# Altium schematic sheet MCU.SchDoc
size 566 x 398 mm; SheetNumber: 2; SheetTotal: 4
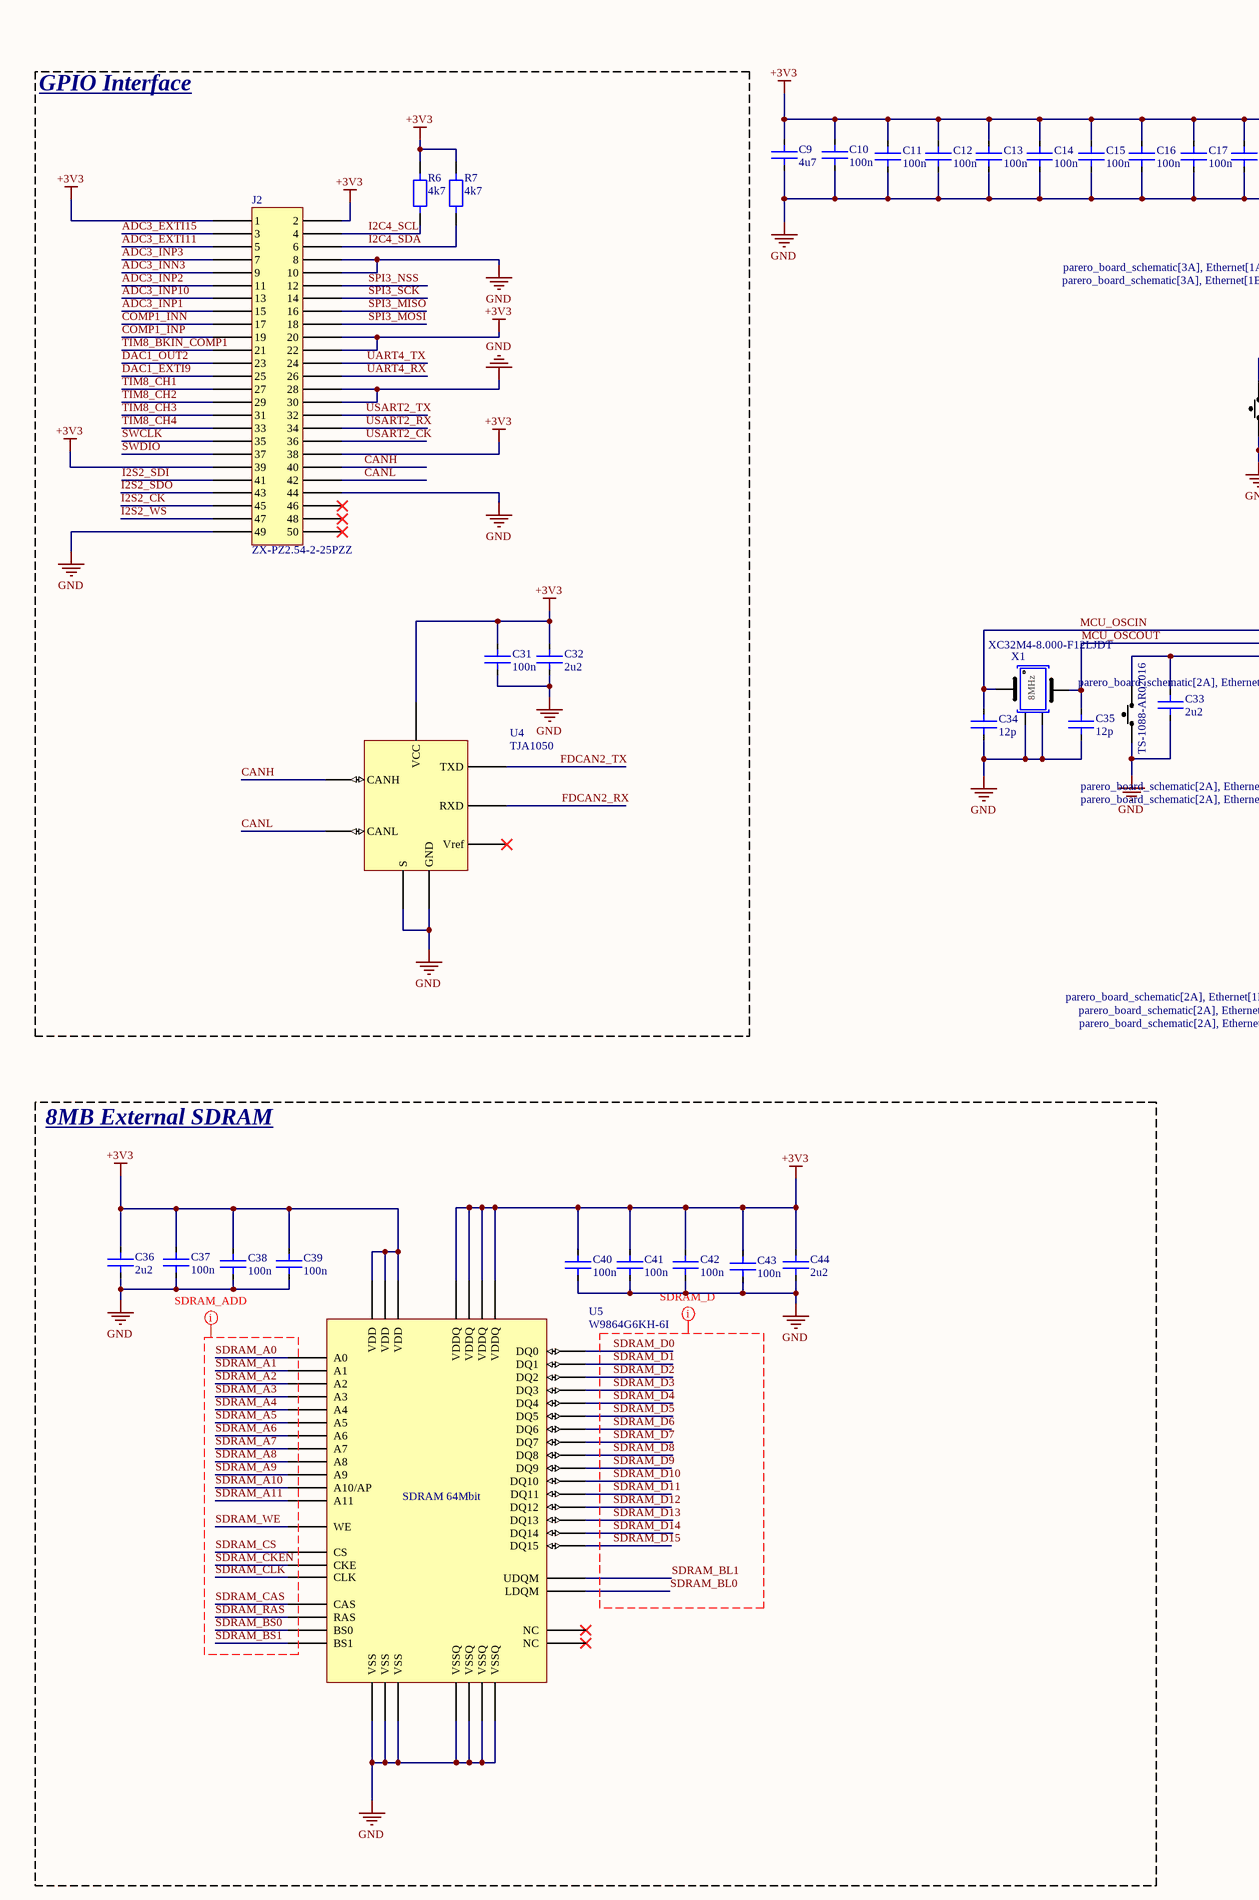
[diagram p0: MCU.SchDoc, left]
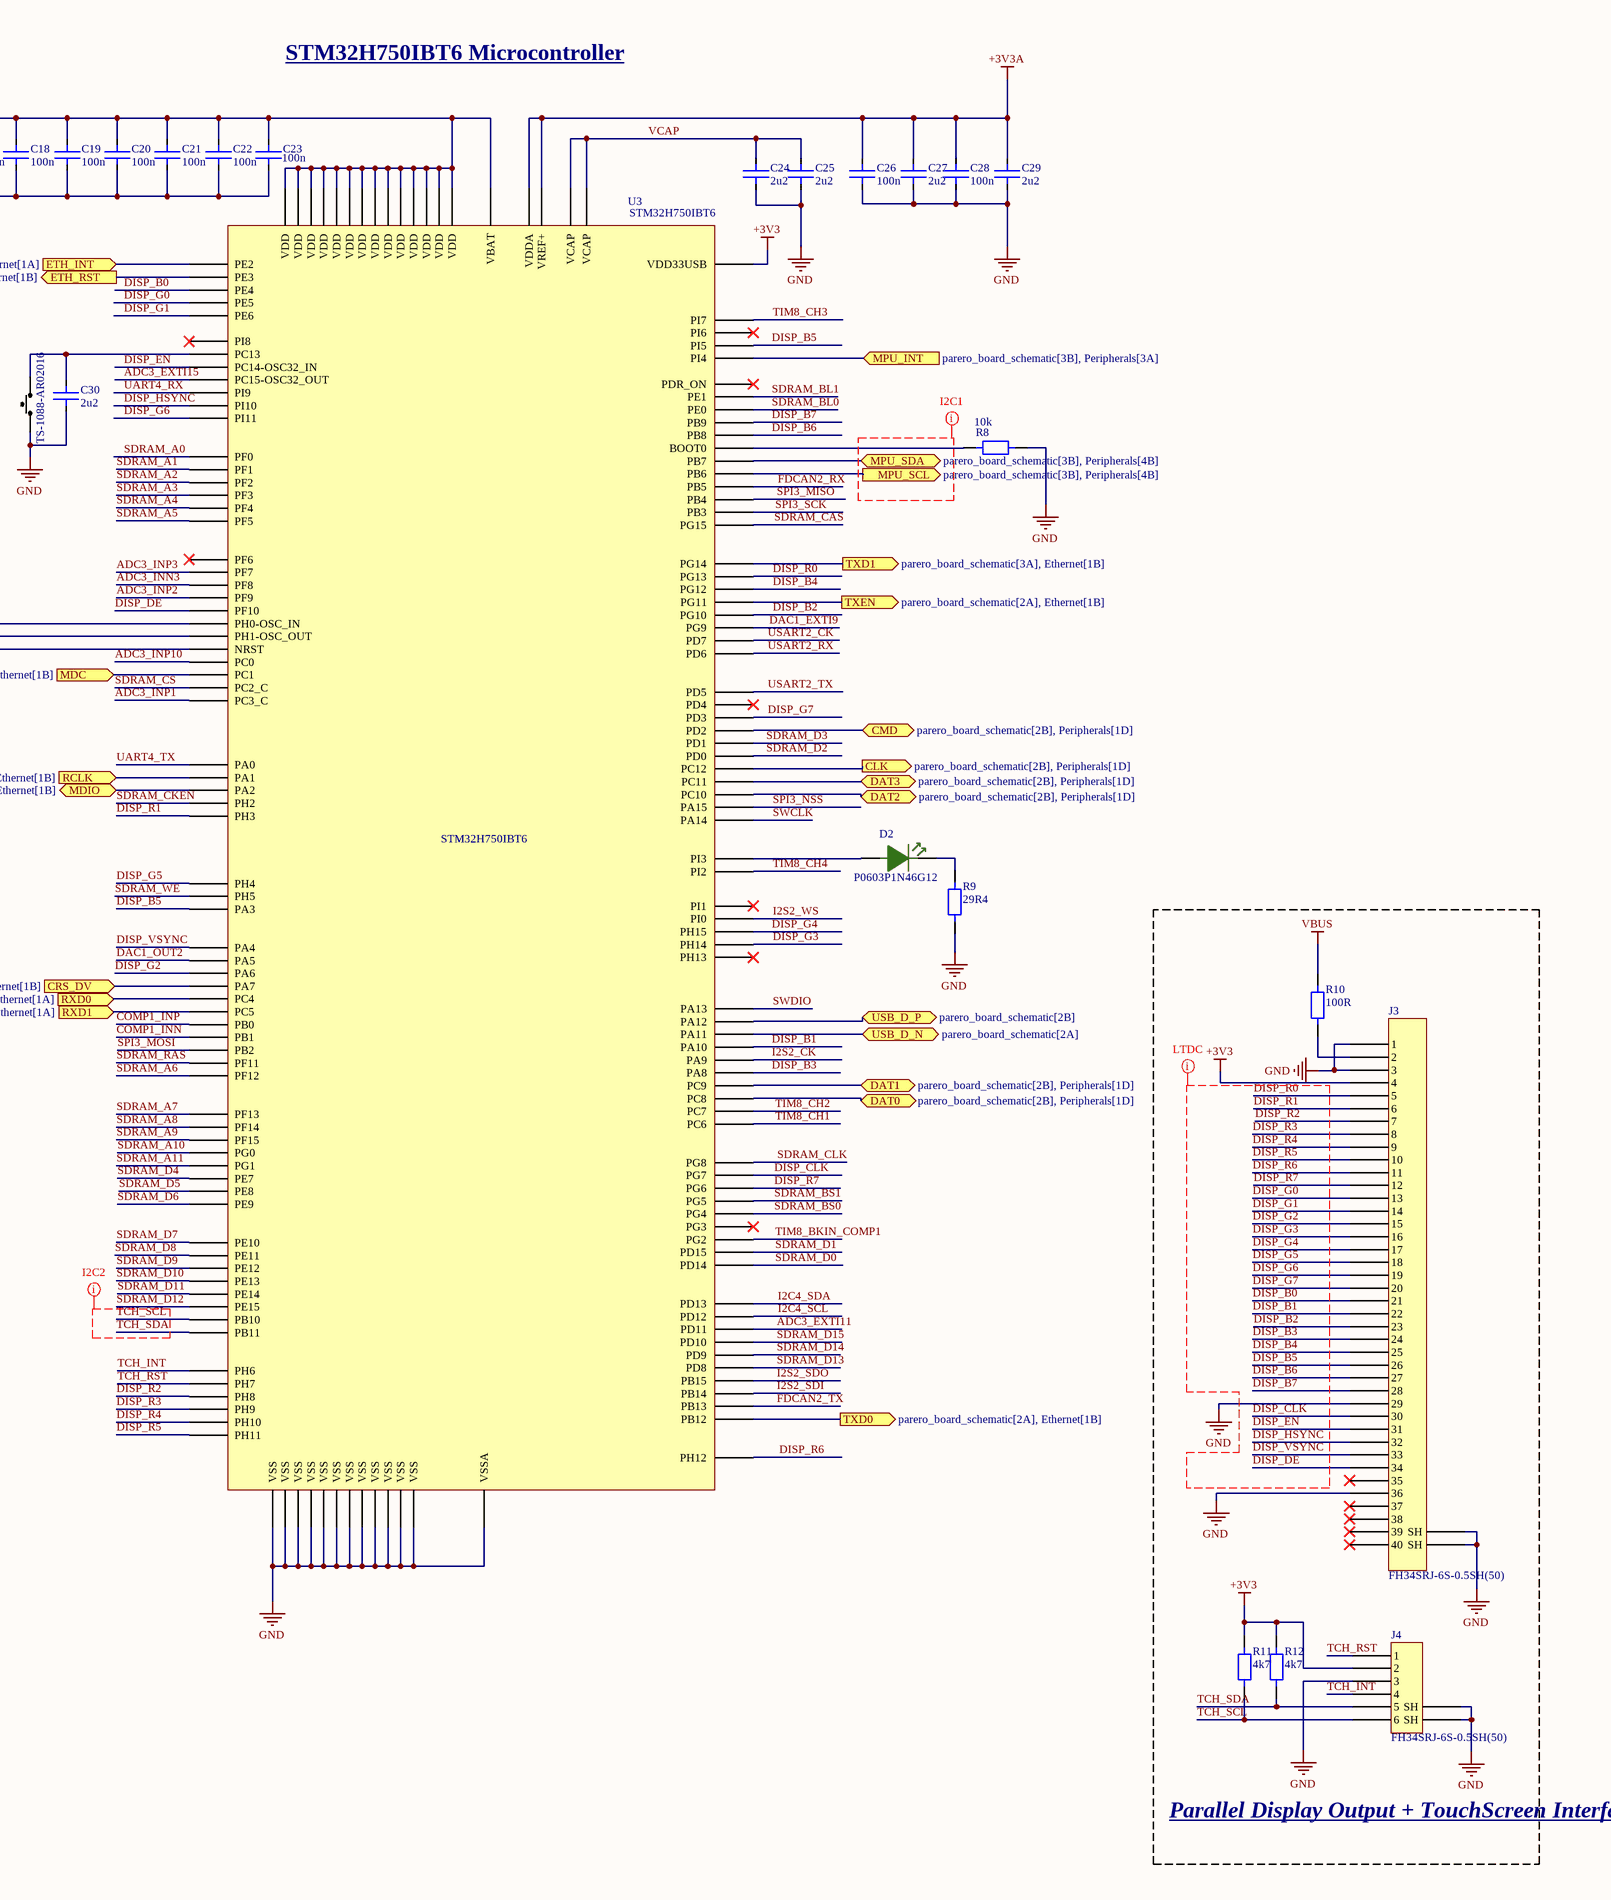
[diagram p1: MCU.SchDoc, right]

## Parts
C9  4u7  [CAP_MLCC_0603]
C10  100n  [CAP_MLCC_0402]
C11  100n  [CAP_MLCC_0402]
C12  100n  [CAP_MLCC_0402]
C13  100n  [CAP_MLCC_0402]
C14  100n  [CAP_MLCC_0402]
C15  100n  [CAP_MLCC_0402]
C16  100n  [CAP_MLCC_0402]
C17  100n  [CAP_MLCC_0402]
C18  100n  [CAP_MLCC_0402]
C19  100n  [CAP_MLCC_0402]
C20  100n  [CAP_MLCC_0402]
C21  100n  [CAP_MLCC_0402]
C22  100n  [CAP_MLCC_0402]
C23  100n  [CAP_MLCC_0402]
C24  2u2  [CAP_MLCC_0402]
C25  2u2  [CAP_MLCC_0402]
C26  100n  [CAP_MLCC_0402]
C27  2u2  [CAP_MLCC_0402]
C28  100n  [CAP_MLCC_0402]
C29  2u2  [CAP_MLCC_0402]
C30  2u2  [CAP_MLCC_0402]
C31  100n  [CAP_MLCC_0402]
C32  2u2  [CAP_MLCC_0603]
C33  2u2  [CAP_MLCC_0402]
C34  12p  [CAP_MLCC_0402]
C35  12p  [CAP_MLCC_0402]
C36  2u2  [CAP_MLCC_0603]
C37  100n  [CAP_MLCC_0402]
C38  100n  [CAP_MLCC_0402]
C39  100n  [CAP_MLCC_0402]
C40  100n  [CAP_MLCC_0402]
C41  100n  [CAP_MLCC_0402]
C42  100n  [CAP_MLCC_0402]
C43  100n  [CAP_MLCC_0402]
C44  2u2  [CAP_MLCC_0603]
D2  P0603P1N46G12  [LED_0603]
J2  ZX-PZ2.54-2-25PZZ  [PIN_HEADER_2X25P]
J3  FH34SRJ-6S-0.5SH(50)  [CONN_CH_SMD_FPC_40P]
J4  FH34SRJ-6S-0.5SH(50)  [CONN_CH_SMD_FPS_6P]
R6  4k7  [RES_SMD_0402]
R7  4k7  [RES_SMD_0402]
R8  10k  [RES_SMD_0402]
R9  29R4  [RES_SMD_0603]
R10  100R  [RES_SMD_0402]
R11  4k7  [RES_SMD_0402]
R12  4k7  [RES_SMD_0402]
SW1  TS-1088-AR02016  [SW_SMD_SPST]
SW2  TS-1088-AR02016  [SW_SMD_SPST]
U3  STM32H750IBT6  [STM32H750IBT6_176QFP]
U4  TJA1050  [TJA1050]
U5  W9864G6KH-6I  [W9864G6KH-6I-TSOP54]
X1  XC32M4-8.000-F12LJDT  [XTAL_SMD_HCL]

## Blocks framed on the sheet
GPIO Interface: C31 C32 J2 R6 R7 U4
Parallel Display Output + TouchScreen Interface: J3 J4 R10-R12
8MB External SDRAM: C36-C44 U5

## Ports
CLK (out, see parero_board_schematic[2B], Peripherals[1D]), CMD (bidir, see parero_board_schematic[2B], Peripherals[1D]), CRS_DV (in, see parero_board_schematic[2A], Ethernet[1B]), DAT0 (bidir, see parero_board_schematic[2B], Peripherals[1D]), DAT1 (bidir, see parero_board_schematic[2B], Peripherals[1D]), DAT2 (bidir, see parero_board_schematic[2B], Peripherals[1D]), DAT3 (bidir, see parero_board_schematic[2B], Peripherals[1D]), ETH_INT (in, see parero_board_schematic[3A], Ethernet[1A]), ETH_RST (out, see parero_board_schematic[3A], Ethernet[1B]), MDC (in, see parero_board_schematic[2A], Ethernet[1B]), MDIO (bidir, see parero_board_schematic[2A], Ethernet[1B]), MPU_INT (in, see parero_board_schematic[3B], Peripherals[3A]), MPU_SCL (out, see parero_board_schematic[3B], Peripherals[4B]), MPU_SDA (bidir, see parero_board_schematic[3B], Peripherals[4B]), RCLK (in, see parero_board_schematic[2A], Ethernet[1B]), RXD0 (in, see parero_board_schematic[2A], Ethernet[1A]), RXD1 (in, see parero_board_schematic[2A], Ethernet[1A]), TXD0 (out, see parero_board_schematic[2A], Ethernet[1B]), TXD1 (out, see parero_board_schematic[3A], Ethernet[1B]), TXEN (out, see parero_board_schematic[2A], Ethernet[1B]), USB_D_N (bidir, see parero_board_schematic[2A]), USB_D_P (bidir, see parero_board_schematic[2B])

## Nets
+3V3: C9.2 C10.2 C11.2 C12.2 C13.2 C14.2 C15.2 C16.2 C17.2 C18.2 C19.2 C20.2 C21.2 C22.2 C23.2 C31.2 C32.2 C36.2 C37.2 C38.2 C39.2 C40.2 C41.2 C42.2 C43.2 C44.2 J2.1 J2.2 J2.20 J2.22 J2.38 J2.39 J3.4 J4.2 R6.2 R7.2 R11.2 R12.2 U3.6(VBAT) U3.15(VDD) U3.23(VDD) U3.36(VDD) U3.49(VDD) U3.62(VDD) U3.72(VDD) U3.82(VDD) U3.91(VDD) U3.103(VDD) U3.114(VDD33USB) U3.127(VDD) U3.136(VDD) U3.149(VDD) U3.159(VDD) U3.172(VDD) U4.3(VCC) U5.1(VDD) U5.3(VDDQ) U5.9(VDDQ) U5.14(VDD) U5.27(VDD) U5.43(VDDQ) U5.49(VDDQ)
+3V3A: C26.2 C27.2 C28.2 C29.2 U3.38(VREF+) U3.39(VDDA)
GND: C9.1 C10.1 C11.1 C12.1 C13.1 C14.1 C15.1 C16.1 C17.1 C18.1 C19.1 C20.1 C21.1 C22.1 C23.1 C24.1 C25.1 C26.1 C27.1 C28.1 C29.1 C30.1 C31.1 C32.1 C33.1 C34.1 C35.1 C36.1 C37.1 C38.1 C39.1 C40.1 C41.1 C42.1 C43.1 C44.1 J2.8 J2.10 J2.28 J2.30 J2.44 J2.49 J3.1 J3.3 J3.29 J3.36 J3.41(SH) J3.42(SH) J4.3 J4.7(SH) J4.8(SH) R8.2 R9.1 SW1.1 SW2.1 U3.14(VSS) U3.22(VSS) U3.37(VSSA) U3.48(VSS) U3.61(VSS) U3.71(VSS) U3.90(VSS) U3.102(VSS) U3.113(VSS) U3.126(VSS) U3.135(VSS) U3.148(VSS) U3.158(VSS) U4.2(GND) U4.8(S) U5.6(VSSQ) U5.12(VSSQ) U5.28(VSS) U5.41(VSS) U5.46(VSSQ) U5.52(VSSQ) U5.54(VSS) X1.2 X1.4
VBUS: R10.2
ADC3_EXTI11: J2.5 U3.99(PD11)
ADC3_EXTI15: J2.3 U3.10(PC15-OSC32_OUT)
ADC3_INN3: J2.9 U3.26(PF8)
ADC3_INP1: J2.15 U3.35(PC3_C)
ADC3_INP2: J2.11 U3.27(PF9)
ADC3_INP3: J2.7 U3.25(PF7)
ADC3_INP10: J2.13 U3.32(PC0)
CANH: J2.40 U4.7(CANH)
CANL: J2.42 U4.6(CANL)
CLK: U3.141(PC12) ; port CLK
CMD: U3.144(PD2) ; port CMD
COMP1_INN: J2.17 U3.57(PB1)
COMP1_INP: J2.19 U3.56(PB0)
CRS_DV: U3.53(PA7) ; port CRS_DV
DAC1_EXTI9: J2.25 U3.152(PG9)
DAC1_OUT2: J2.23 U3.51(PA5)
DAT0: U3.117(PC8) ; port DAT0
DAT1: U3.118(PC9) ; port DAT1
DAT2: U3.139(PC10) ; port DAT2
DAT3: U3.140(PC11) ; port DAT3
DISP_B0: J3.21 U3.3(PE4)
DISP_B1: J3.22 U3.121(PA10)
DISP_B2: J3.23 U3.153(PG10)
DISP_B3: J3.24 U3.119(PA8)
DISP_B4: J3.25 U3.155(PG12)
DISP_B5: J3.26 U3.47(PA3) U3.174(PI5)
DISP_B6: J3.27 U3.167(PB8)
DISP_B7: J3.28 U3.168(PB9)
DISP_CLK: J3.30 U3.111(PG7)
DISP_DE: J3.34 U3.28(PF10)
DISP_EN: J3.31 U3.9(PC14-OSC32_IN)
DISP_G0: J3.13 U3.4(PE5)
DISP_G1: J3.14 U3.5(PE6)
DISP_G2: J3.15 U3.52(PA6)
DISP_G3: J3.16 U3.129(PH14)
DISP_G4: J3.17 U3.130(PH15)
DISP_G5: J3.18 U3.45(PH4)
DISP_G6: J3.19 U3.13(PI11)
DISP_G7: J3.20 U3.145(PD3)
DISP_HSYNC: J3.32 U3.12(PI10)
DISP_R0: J3.5 U3.156(PG13)
DISP_R1: J3.6 U3.44(PH3)
DISP_R2: J3.7 U3.85(PH8)
DISP_R3: J3.8 U3.86(PH9)
DISP_R4: J3.9 U3.87(PH10)
DISP_R5: J3.10 U3.88(PH11)
DISP_R6: J3.11 U3.89(PH12)
DISP_R7: J3.12 U3.110(PG6)
DISP_VSYNC: J3.33 U3.50(PA4)
ETH_INT: U3.1(PE2) ; port ETH_INT
ETH_RST: U3.2(PE3) ; port ETH_RST
FDCAN2_RX: U3.163(PB5) U4.4(RXD)
FDCAN2_TX: U3.93(PB13) U4.1(TXD)
I2C4_SCL: J2.4 R6.1 U3.100(PD12)
I2C4_SDA: J2.6 R7.1 U3.101(PD13)
I2S2_CK: J2.45 U3.120(PA9)
I2S2_SDI: J2.41 U3.94(PB14)
I2S2_SDO: J2.43 U3.95(PB15)
I2S2_WS: J2.47 U3.131(PI0)
MCU_OSCIN: C34.2 U3.29(PH0-OSC_IN) X1.1
MCU_OSCOUT: C35.2 U3.30(PH1-OSC_OUT) X1.3
MDC: U3.33(PC1) ; port MDC
MDIO: U3.42(PA2) ; port MDIO
MPU_INT: U3.173(PI4) ; port MPU_INT
MPU_SCL: U3.164(PB6) ; port MPU_SCL
MPU_SDA: U3.165(PB7) ; port MPU_SDA
RCLK: U3.41(PA1) ; port RCLK
RXD0: U3.54(PC4) ; port RXD0
RXD1: U3.55(PC5) ; port RXD1
SDRAM_A0: U3.16(PF0) U5.23(A0)
SDRAM_A1: U3.17(PF1) U5.24(A1)
SDRAM_A2: U3.18(PF2) U5.25(A2)
SDRAM_A3: U3.19(PF3) U5.26(A3)
SDRAM_A4: U3.20(PF4) U5.29(A4)
SDRAM_A5: U3.21(PF5) U5.30(A5)
SDRAM_A6: U3.60(PF12) U5.31(A6)
SDRAM_A7: U3.63(PF13) U5.32(A7)
SDRAM_A8: U3.64(PF14) U5.33(A8)
SDRAM_A9: U3.65(PF15) U5.34(A9)
SDRAM_A10: U3.66(PG0) U5.22(A10/AP)
SDRAM_A11: U3.67(PG1) U5.35(A11)
SDRAM_BL0: U3.169(PE0) U5.15(LDQM)
SDRAM_BL1: U3.170(PE1) U5.39(UDQM)
SDRAM_BS0: U3.108(PG4) U5.20(BS0)
SDRAM_BS1: U3.109(PG5) U5.21(BS1)
SDRAM_CAS: U3.160(PG15) U5.17(CAS)
SDRAM_CKEN: U3.43(PH2) U5.37(CKE)
SDRAM_CLK: U3.112(PG8) U5.38(CLK)
SDRAM_CS: U3.34(PC2_C) U5.19(CS)
SDRAM_D0: U3.104(PD14) U5.2(DQ0)
SDRAM_D1: U3.105(PD15) U5.4(DQ1)
SDRAM_D2: U3.142(PD0) U5.5(DQ2)
SDRAM_D3: U3.143(PD1) U5.7(DQ3)
SDRAM_D4: U3.68(PE7) U5.8(DQ4)
SDRAM_D5: U3.69(PE8) U5.10(DQ5)
SDRAM_D6: U3.70(PE9) U5.11(DQ6)
SDRAM_D7: U3.73(PE10) U5.13(DQ7)
SDRAM_D8: U3.74(PE11) U5.42(DQ8)
SDRAM_D9: U3.75(PE12) U5.44(DQ9)
SDRAM_D10: U3.76(PE13) U5.45(DQ10)
SDRAM_D11: U3.77(PE14) U5.47(DQ11)
SDRAM_D12: U3.78(PE15) U5.48(DQ12)
SDRAM_D13: U3.96(PD8) U5.50(DQ13)
SDRAM_D14: U3.97(PD9) U5.51(DQ14)
SDRAM_D15: U3.98(PD10) U5.53(DQ15)
SDRAM_RAS: U3.59(PF11) U5.18(RAS)
SDRAM_WE: U3.46(PH5) U5.16(WE)
SPI3_MISO: J2.16 U3.162(PB4)
SPI3_MOSI: J2.18 U3.58(PB2)
SPI3_NSS: J2.12 U3.138(PA15)
SPI3_SCK: J2.14 U3.161(PB3)
SWCLK: J2.35 U3.137(PA14)
SWDIO: J2.37 U3.124(PA13)
TCH_INT: J4.4 U3.83(PH6)
TCH_RST: J4.1 U3.84(PH7)
TCH_SCL: J4.6 R11.1 U3.79(PB10)
TCH_SDA: J4.5 R12.1 U3.80(PB11)
TIM8_BKIN_COMP1: J2.21 U3.106(PG2)
TIM8_CH1: J2.27 U3.115(PC6)
TIM8_CH2: J2.29 U3.116(PC7)
TIM8_CH3: J2.31 U3.176(PI7)
TIM8_CH4: J2.33 U3.133(PI2)
TXD0: U3.92(PB12) ; port TXD0
TXD1: U3.157(PG14) ; port TXD1
TXEN: U3.154(PG11) ; port TXEN
UART4_RX: J2.26 U3.11(PI9)
UART4_TX: J2.24 U3.40(PA0)
USART2_CK: J2.36 U3.151(PD7)
USART2_RX: J2.34 U3.150(PD6)
USART2_TX: J2.32 U3.147(PD5)
USB_D_N: U3.122(PA11) ; port USB_D_N
USB_D_P: U3.123(PA12) ; port USB_D_P
VCAP: C24.2 C25.2 U3.81(VCAP) U3.125(VCAP)
NetC30_2: C30.2 SW1.2 U3.8(PC13)
NetC33_2: C33.2 SW2.2 U3.31(NRST)
NetD2_1: D2.1 R9.2
NetD2_2: D2.2 U3.134(PI3)
NetJ3_2: J3.2 R10.1
NetR8_1: R8.1 U3.166(BOOT0)

Not connected (* = marked no-connect by the designer): J2 46* 48* 50*; J3 35* 37* 38* 39* 40*; U3 7(PI8)* 24(PF6)* 107(PG3)* 128(PH13)* 132(PI1)* 146(PD4)* 171(PDR_ON)* 175(PI6)*; U4 5(Vref)*; U5 36(NC)* 40(NC)*

## Layout directives
net class SDRAM_DGRP: SDRAM_BL0, SDRAM_BL1, SDRAM_D0, SDRAM_D1, SDRAM_D2, SDRAM_D3, SDRAM_D4, SDRAM_D5, SDRAM_D6, SDRAM_D7, SDRAM_D8, SDRAM_D9, SDRAM_D10, SDRAM_D11, SDRAM_D12, SDRAM_D13, SDRAM_D14, SDRAM_D15
net class LTDC: DISP_B0, DISP_B1, DISP_B2, DISP_B3, DISP_B4, DISP_B5, DISP_B6, DISP_B7, DISP_CLK, DISP_DE, DISP_EN, DISP_G0, DISP_G1, DISP_G2, DISP_G3, DISP_G4, DISP_G5, DISP_G6, DISP_G7, DISP_HSYNC, DISP_R0, DISP_R1, DISP_R2, DISP_R3, DISP_R4, DISP_R5, DISP_R6, DISP_R7, DISP_VSYNC
mark named I2C1: (no net found under the mark)
mark named I2C2: TCH_SCL, TCH_SDA
net class SDRAM_AGRP: SDRAM_A0, SDRAM_A1, SDRAM_A2, SDRAM_A3, SDRAM_A4, SDRAM_A5, SDRAM_A6, SDRAM_A7, SDRAM_A8, SDRAM_A9, SDRAM_A10, SDRAM_A11, SDRAM_BS0, SDRAM_BS1, SDRAM_CAS, SDRAM_CKEN, SDRAM_CLK, SDRAM_CS, SDRAM_RAS, SDRAM_WE

## Notes on the sheet
- STM32H750IBT6 Microcontroller
- (in symbol Crystal SMD 8MHz) 8MHz
- (in symbol Memory SDRAM W9864G6KH-6I) SDRAM 64Mbit

## Library data of the parts
C9 = Cap MLCC 0603: Multilayer  Ceramic Capacitor; Manufacturer 1: muRata; Manufacturer Part Number 1: GRM188R60J475KE19D; Designator: C?; Quantity: *
C10-C23 C31 C37-C43 = Cap MLCC 0402: Multilayer  Ceramic Capacitor; Manufacturer 1: Samsung Electro-Mechanics; Manufacturer Part Number 1: CL05B104KO5NNNC; Designator: C?; Quantity: *
  C10-C18 C20-C23: Parameter 1: *
C24 C25 C27 C29 C30 C33 = Cap MLCC 0402: Multilayer  Ceramic Capacitor; Manufacturer 1: muRata; Manufacturer Part Number 1: GRM155R61A225KE95D; Designator: C?; Quantity: *
C26 C28 = Cap MLCC 0402: Multilayer  Ceramic Capacitor; Designator: C?; Manufacturer 1: *; Manufacturer Part Number 1: *; Quantity: *; Parameter 1: *
C32 C36 C44 = Cap MLCC 0603: Multilayer  Ceramic Capacitor; Manufacturer 1: Samsung Electro-Mechanics; Manufacturer Part Number 1: CL10A225KA8NNNC; Designator: C?; Quantity: *
C34 C35 = Cap MLCC 0402: Multilayer  Ceramic Capacitor; Manufacturer 1: muRata; Manufacturer Part Number 1: GRM1555C1H120GA01D; Designator: C?; Quantity: *
D2 = Diode LED G: 1200mcd 518nm~524nm Green 3V 0603 LED Indication - Discrete ROHS; Manufacturer 1: Silverlight; Manufacturer Part Number 1: P0603P1N46G12; Quantity: *; ComponentLink1Description: Datasheet; ComponentLink1URL: https://www.lcsc.com/datasheet/C5123548.pdf; ComponentLink2Description: Product Link; ComponentLink2URL: https://www.lcsc.com/product-detail/C5123548.html
J2 = Pin Header 2X25 Pitch 2.54mm: 2x25P 50P Gold Brass -40℃~+105℃ Pin Header Black 2.54mm 2.5mm 6mm 1kV 3mm 3A 2 Through Hole 2.54mm Through Hole,P=2.54mm Headers, Male Pins RoHS; Manufacturer 1: Megastar; Designator: J?; Manufacturer Part Number 1: ZX-PZ2.54-2-25PZZ; Quantity: *; ComponentLink1Description: Product Link; ComponentLink1URL: https://www.lcsc.com/product-detail/C7501284.html; ComponentLink2Description: Datasheet; ComponentLink2URL: https://www.lcsc.com/datasheet/C7501284.pdf
J3 = Connector FFC_40PH CH: -55℃~+105℃ 6P 0.5mm Double-Sided Contacts, Top and Bottom Entry Surface Mount, Right Angle SMD,P=0.5mm,Surface Mount,Right Angle FFC, FPC (Flat Flexible) Connector Assemblies RoHS; Manufacturer 1: HRS; Designator: J?; Manufacturer Part Number 1: FH34SRJ-6S-0.5SH(50); Quantity: *; ComponentLink1Description: Product Link; ComponentLink1URL: https://www.lcsc.com/product-detail/C224194.html; ComponentLink2Description: Datasheet; ComponentLink2URL: https://item.szlcsc.com/datasheet/AFC01-S40FCA-00/253933.html?lcsc_vid=QlAKU11QQVEKAwJVFVlZAVZfFgcNAwFWR1JaBVRSFAAxVlNQRVZYU1xXRVhXVjsOAxUeFF5JWBEcCEoDFhIXAgAHWQIBCks%3D
J4 = Connector FFC_6PH CH: -55℃~+105℃ 6P 0.5mm Double-Sided Contacts, Top and Bottom Entry Surface Mount, Right Angle SMD,P=0.5mm,Surface Mount,Right Angle FFC, FPC (Flat Flexible) Connector Assemblies RoHS; Manufacturer 1: HRS; Designator: J?; Manufacturer Part Number 1: FH34SRJ-6S-0.5SH(50); Quantity: *; ComponentLink1Description: Product Link; ComponentLink1URL: https://www.lcsc.com/product-detail/C224194.html; ComponentLink2Description: Datasheet; ComponentLink2URL: https://www.lcsc.com/datasheet/C224194.pdf
R6 R7 R11 R12 = Resistor 0402: General Purpose SMD Carbon Resistor; Manufacturer 1: UNI-ROYAL; Manufacturer Part Number 1: 0402WGF4701TCE; Designator: R?; Quantity: *
R8 = Resistor 0402: General Purpose SMD Carbon Resistor; Manufacturer 1: UNI-ROYAL; Manufacturer Part Number 1: 0402WGF1002TCE; Designator: R?; Quantity: *
R9 = Resistor 0603: General Purpose SMD Carbon Resistor; Manufacturer 1: UNI-ROYAL; Manufacturer Part Number 1: 0603WAF294JT5E; Designator: R?; Quantity: *
R10 = Resistor 0402: General Purpose SMD Carbon Resistor; Manufacturer 1: UNI-ROYAL; Manufacturer Part Number 1: 0402WGF1000TCE; Designator: R?; Quantity: *
SW1 SW2 = Switch SMD SPST: Without Bracket 4mm 12V 3mm Round Button SPST 50mA SMD,4x3mm Tactile Switches ROHS; Manufacturer 1: XUNPU; Designator: SW?; Manufacturer Part Number 1: TS-1088-AR02016; Quantity: *; ComponentLink1Description: Datasheet; ComponentLink1URL: https://item.szlcsc.com/datasheet/TS-1088-AR02016/763484.html?lcsc_vid=T1EMVlBfE1BXVVADFQQNUlMFT1RXUAZeFlhfBlAAQVExVlNQR1lZUlJWR1BfVTsOAxUeFF5JWBEcCEoDFhIXAgAHWQIBCks%3D; ComponentLink2Description: Product Link; ComponentLink2URL: https://www.lcsc.com/product-detail/C720477.html
U3 = MCU STM32H750IBT6: ARM Cortex-M Series 480MHz 140 LQFP-176(24x24) Microcontrollers RoHS; Manufacturer 1: ST; Designator: U?; Manufacturer Part Number 1: ARM Cortex-M Series 480MHz 140 LQFP-176(24x24) Microcontrollers RoHS; Quantity: *; ComponentLink1Description: Product Link; ComponentLink1URL: https://www.lcsc.com/product-detail/C730201.html; ComponentLink2Description: Datasheet; ComponentLink2URL: https://www.lcsc.com/datasheet/C730201.pdf
U4 = Interface CAN Transceiver TJA1050: 1Mbps 4.75V~5.25V 50mA CAN Transceiver SOP-8 CAN Transceivers ROHS; Manufacturer Part Number 1: TJA1050T/CM,118; Manufacturer 1: NXP Semicon; Designator: U?; Quantity: *; ComponentLink1Description: Product Link; ComponentLink1URL: *; ComponentLink2Description: Datasheet; ComponentLink2URL: https://www.nxp.com/docs/en/data-sheet/TJA1050.pdf
U5 = Memory SDRAM W9864G6KH-6I: 64Mbit 3V~3.6V 166MHz TSOP-54-10.2mm Memory (ICs) RoHS; Manufacturer 1: Winbond; Quantity: *; Manufacturer Part Number 1: W9864G6KH-6I; ComponentLink1Description: Datasheet; ComponentLink1URL: https://www.lcsc.com/datasheet/C503937.pdf; ComponentLink2Description: Product Link; ComponentLink2URL: https://www.lcsc.com/product-detail/C503937.html
X1 = Crystal SMD 8MHz: Crystal Oscillator 12pF SMD3225-4P Crystals RoHS; Manufacturer 1: HCI; Designator: X?; Manufacturer Part Number 1: XC32M4-8.000-F12LJDT; Quantity: *; ComponentLink1Description: Datasheet; ComponentLink1URL: https://www.lcsc.com/datasheet/C2842191.pdf; ComponentLink2Description: Product Link; ComponentLink2URL: https://www.lcsc.com/datasheet/C2842191.pdf